# Altium schematic sheet 1.CONNECTOR.SchDoc
size 513 x 386 mm
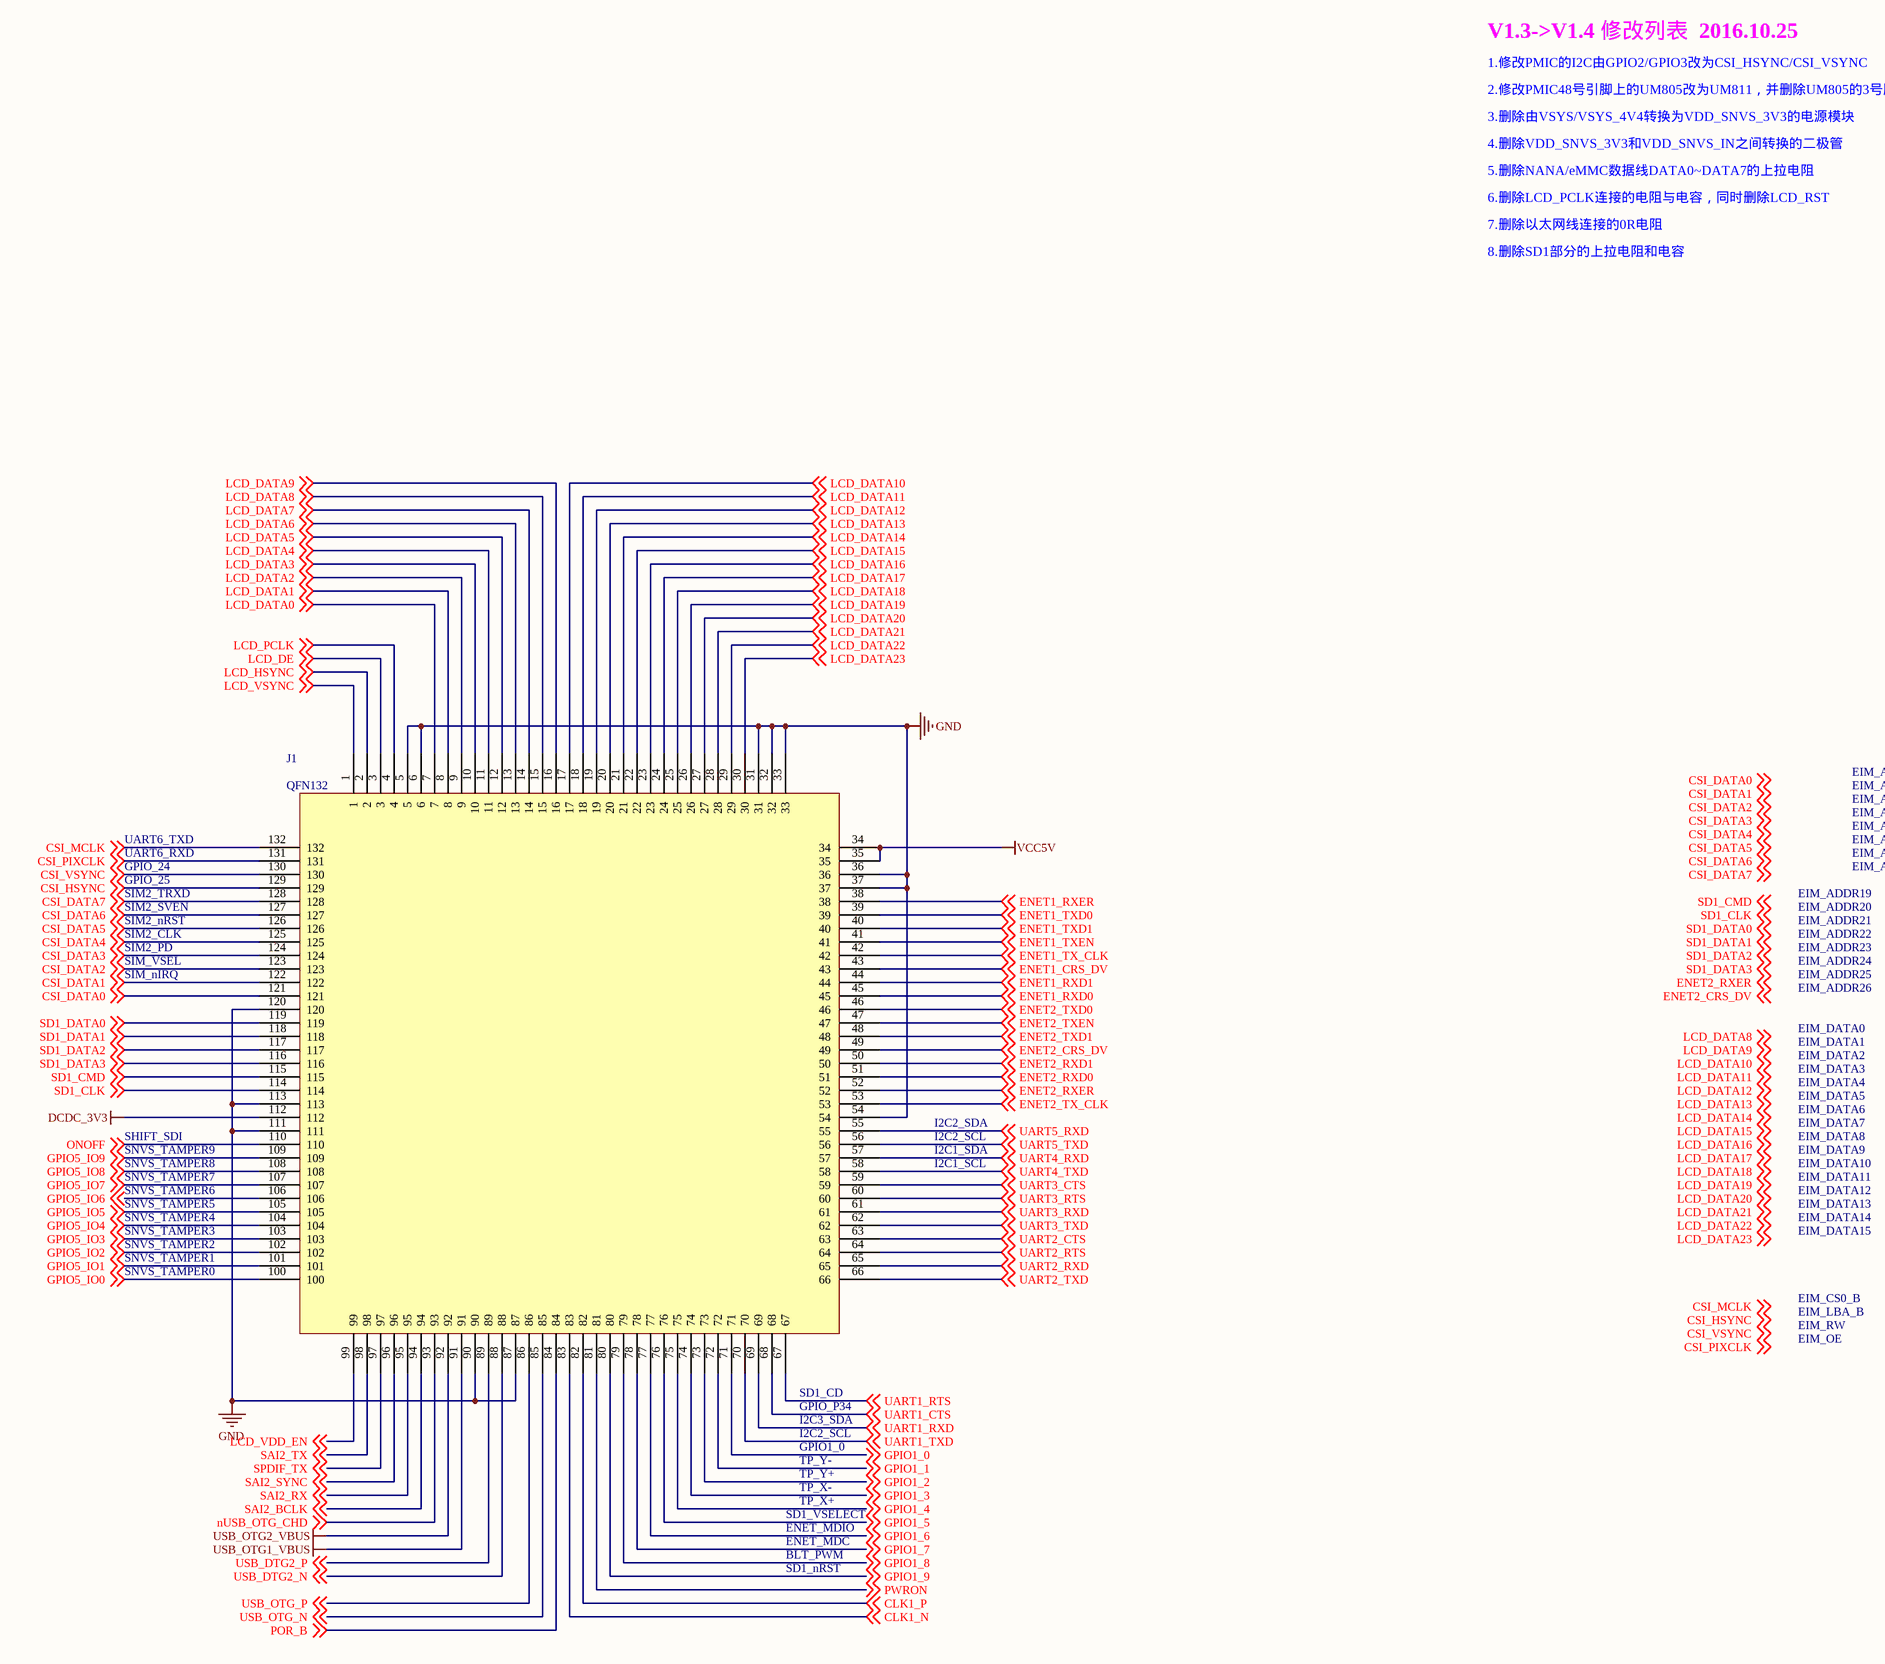
[diagram p0: 1.CONNECTOR.SchDoc]

## Parts
J1  QFN132  [YPK33X4]

## Nets
DCDC_3V3: J1.112
GND: J1.5 J1.6 J1.31 J1.32 J1.33 J1.36 J1.37 J1.54 J1.87 J1.90 J1.111 J1.113 J1.120
USB_OTG1_VBUS: J1.91
USB_OTG2_VBUS: J1.92
VCC5V: J1.34 J1.35
CLK1_N: J1.83 ; off-sheet CLK1_N
CLK1_P: J1.82 ; off-sheet CLK1_P
CSI_DATA0: J1.121 ; off-sheet CSI_DATA0
CSI_DATA1: J1.122 ; off-sheet CSI_DATA1
CSI_DATA2: J1.123 ; off-sheet CSI_DATA2
CSI_DATA3: J1.124 ; off-sheet CSI_DATA3
CSI_DATA4: J1.125 ; off-sheet CSI_DATA4
CSI_DATA5: J1.126 ; off-sheet CSI_DATA5
CSI_DATA6: J1.127 ; off-sheet CSI_DATA6
CSI_DATA7: J1.128 ; off-sheet CSI_DATA7
CSI_HSYNC: J1.129 ; off-sheet CSI_HSYNC
CSI_MCLK: J1.132 ; off-sheet CSI_MCLK
CSI_PIXCLK: J1.131 ; off-sheet CSI_PIXCLK
CSI_VSYNC: J1.130 ; off-sheet CSI_VSYNC
ENET1_CRS_DV: J1.43 ; off-sheet ENET1_CRS_DV
ENET1_RXD0: J1.45 ; off-sheet ENET1_RXD0
ENET1_RXD1: J1.44 ; off-sheet ENET1_RXD1
ENET1_RXER: J1.38 ; off-sheet ENET1_RXER
ENET1_TX_CLK: J1.42 ; off-sheet ENET1_TX_CLK
ENET1_TXD0: J1.39 ; off-sheet ENET1_TXD0
ENET1_TXD1: J1.40 ; off-sheet ENET1_TXD1
ENET1_TXEN: J1.41 ; off-sheet ENET1_TXEN
ENET2_CRS_DV: J1.49 ; off-sheet ENET2_CRS_DV
ENET2_RXD0: J1.51 ; off-sheet ENET2_RXD0
ENET2_RXD1: J1.50 ; off-sheet ENET2_RXD1
ENET2_RXER: J1.52 ; off-sheet ENET2_RXER
ENET2_TX_CLK: J1.53 ; off-sheet ENET2_TX_CLK
ENET2_TXD0: J1.46 ; off-sheet ENET2_TXD0
ENET2_TXD1: J1.48 ; off-sheet ENET2_TXD1
ENET2_TXEN: J1.47 ; off-sheet ENET2_TXEN
GPIO1_0: J1.71 ; off-sheet GPIO1_0
GPIO1_1: J1.72 ; off-sheet GPIO1_1
GPIO1_2: J1.73 ; off-sheet GPIO1_2
GPIO1_3: J1.74 ; off-sheet GPIO1_3
GPIO1_4: J1.75 ; off-sheet GPIO1_4
GPIO1_5: J1.76 ; off-sheet GPIO1_5
GPIO1_6: J1.77 ; off-sheet GPIO1_6
GPIO1_7: J1.78 ; off-sheet GPIO1_7
GPIO1_8: J1.79 ; off-sheet GPIO1_8
GPIO1_9: J1.80 ; off-sheet GPIO1_9
GPIO5_IO0: J1.100 ; off-sheet GPIO5_IO0
GPIO5_IO1: J1.101 ; off-sheet GPIO5_IO1
GPIO5_IO2: J1.102 ; off-sheet GPIO5_IO2
GPIO5_IO3: J1.103 ; off-sheet GPIO5_IO3
GPIO5_IO4: J1.104 ; off-sheet GPIO5_IO4
GPIO5_IO5: J1.105 ; off-sheet GPIO5_IO5
GPIO5_IO6: J1.106 ; off-sheet GPIO5_IO6
GPIO5_IO7: J1.107 ; off-sheet GPIO5_IO7
GPIO5_IO8: J1.108 ; off-sheet GPIO5_IO8
GPIO5_IO9: J1.109 ; off-sheet GPIO5_IO9
LCD_DATA0: J1.7 ; off-sheet LCD_DATA0
LCD_DATA1: J1.8 ; off-sheet LCD_DATA1
LCD_DATA2: J1.9 ; off-sheet LCD_DATA2
LCD_DATA3: J1.10 ; off-sheet LCD_DATA3
LCD_DATA4: J1.11 ; off-sheet LCD_DATA4
LCD_DATA5: J1.12 ; off-sheet LCD_DATA5
LCD_DATA6: J1.13 ; off-sheet LCD_DATA6
LCD_DATA7: J1.14 ; off-sheet LCD_DATA7
LCD_DATA8: J1.15 ; off-sheet LCD_DATA8
LCD_DATA9: J1.16 ; off-sheet LCD_DATA9
LCD_DATA10: J1.17 ; off-sheet LCD_DATA10
LCD_DATA11: J1.18 ; off-sheet LCD_DATA11
LCD_DATA12: J1.19 ; off-sheet LCD_DATA12
LCD_DATA13: J1.20 ; off-sheet LCD_DATA13
LCD_DATA14: J1.21 ; off-sheet LCD_DATA14
LCD_DATA15: J1.22 ; off-sheet LCD_DATA15
LCD_DATA16: J1.23 ; off-sheet LCD_DATA16
LCD_DATA17: J1.24 ; off-sheet LCD_DATA17
LCD_DATA18: J1.25 ; off-sheet LCD_DATA18
LCD_DATA19: J1.26 ; off-sheet LCD_DATA19
LCD_DATA20: J1.27 ; off-sheet LCD_DATA20
LCD_DATA21: J1.28 ; off-sheet LCD_DATA21
LCD_DATA22: J1.29 ; off-sheet LCD_DATA22
LCD_DATA23: J1.30 ; off-sheet LCD_DATA23
LCD_DE: J1.3 ; off-sheet LCD_DE
LCD_HSYNC: J1.2 ; off-sheet LCD_HSYNC
LCD_PCLK: J1.4 ; off-sheet LCD_PCLK
LCD_VDD_EN: J1.99 ; off-sheet LCD_VDD_EN
LCD_VSYNC: J1.1 ; off-sheet LCD_VSYNC
nUSB_OTG_CHD: J1.93 ; off-sheet nUSB_OTG_CHD
ONOFF: J1.110 ; off-sheet ONOFF
POR_B: J1.84 ; off-sheet POR_B
PWRON: J1.81 ; off-sheet PWRON
SAI2_BCLK: J1.94 ; off-sheet SAI2_BCLK
SAI2_RX: J1.95 ; off-sheet SAI2_RX
SAI2_SYNC: J1.96 ; off-sheet SAI2_SYNC
SAI2_TX: J1.98 ; off-sheet SAI2_TX
SD1_CLK: J1.114 ; off-sheet SD1_CLK
SD1_CMD: J1.115 ; off-sheet SD1_CMD
SD1_DATA0: J1.119 ; off-sheet SD1_DATA0
SD1_DATA1: J1.118 ; off-sheet SD1_DATA1
SD1_DATA2: J1.117 ; off-sheet SD1_DATA2
SD1_DATA3: J1.116 ; off-sheet SD1_DATA3
SPDIF_TX: J1.97 ; off-sheet SPDIF_TX
UART1_CTS: J1.68 ; off-sheet UART1_CTS
UART1_RTS: J1.67 ; off-sheet UART1_RTS
UART1_RXD: J1.69 ; off-sheet UART1_RXD
UART1_TXD: J1.70 ; off-sheet UART1_TXD
UART2_CTS: J1.63 ; off-sheet UART2_CTS
UART2_RTS: J1.64 ; off-sheet UART2_RTS
UART2_RXD: J1.65 ; off-sheet UART2_RXD
UART2_TXD: J1.66 ; off-sheet UART2_TXD
UART3_CTS: J1.59 ; off-sheet UART3_CTS
UART3_RTS: J1.60 ; off-sheet UART3_RTS
UART3_RXD: J1.61 ; off-sheet UART3_RXD
UART3_TXD: J1.62 ; off-sheet UART3_TXD
UART4_RXD: J1.57 ; off-sheet UART4_RXD
UART4_TXD: J1.58 ; off-sheet UART4_TXD
UART5_RXD: J1.55 ; off-sheet UART5_RXD
UART5_TXD: J1.56 ; off-sheet UART5_TXD
USB_DTG2_N: J1.88 ; off-sheet USB_DTG2_N
USB_DTG2_P: J1.89 ; off-sheet USB_DTG2_P
USB_OTG_N: J1.85 ; off-sheet USB_OTG_N
USB_OTG_P: J1.86 ; off-sheet USB_OTG_P

## Notes on the sheet
- V1.3->V1.4 修改列表  2016.10.25
- 1.修改PMIC的I2C由GPIO2/GPIO3改为CSI_HSYNC/CSI_VSYNC
- 2.修改PMIC48号引脚上的UM805改为UM811，并删除UM805的3号脚的上拉电阻
- 3.删除由VSYS/VSYS_4V4转换为VDD_SNVS_3V3的电源模块
- 4.删除VDD_SNVS_3V3和VDD_SNVS_IN之间转换的二极管
- 5.删除NANA/eMMC数据线DATA0~DATA7的上拉电阻
- 6.删除LCD_PCLK连接的电阻与电容，同时删除LCD_RST
- 7.删除以太网线连接的0R电阻
- 8.删除SD1部分的上拉电阻和电容
- EIM_AD0
- EIM_AD4
- EIM_AD3
- EIM_AD2
- EIM_AD1
- UART6_TXD
- UART6_RXD
- GPIO_24
- GPIO_25
- SIM2_TRXD
- EIM_ADDR19
- EIM_AD7
- EIM_AD6
- EIM_AD5
- SIM_VSEL
- SIM2_PD
- SIM2_CLK
- SIM2_nRST
- SIM2_SVEN
- EIM_ADDR20
- EIM_ADDR21
- EIM_ADDR22
- EIM_ADDR23
- EIM_ADDR24
- SIM_nIRQ
- EIM_ADDR26
- EIM_ADDR25
- EIM_DATA0
- EIM_DATA1
- EIM_DATA2
- EIM_DATA3
- EIM_DATA4
- EIM_DATA5
- SNVS_TAMPER8
- SNVS_TAMPER9
- SHIFT_SDI
- I2C1_SCL
- I2C1_SDA
- I2C2_SCL
- I2C2_SDA
- EIM_DATA6
- EIM_DATA7
- EIM_DATA8
- EIM_DATA9
- EIM_DATA10
- SNVS_TAMPER3
- SNVS_TAMPER4
- SNVS_TAMPER5
- SNVS_TAMPER7
- SNVS_TAMPER6
- EIM_DATA11
- EIM_DATA12
- EIM_DATA13
- EIM_DATA14
- EIM_DATA15
- SNVS_TAMPER0
- SNVS_TAMPER1
- SNVS_TAMPER2
- EIM_CS0_B
- EIM_LBA_B
- EIM_RW
- EIM_OE
- I2C3_SDA
- SD1_CD
- GPIO_P34
- GPIO1_0
- TP_Y-
- TP_Y+
- TP_X-
- TP_X+
- SD1_VSELECT
- ENET_MDIO
- ENET_MDC
- BLT_PWM
- SD1_nRST
- Labels drawn without touching a wire or pin: CSI_DATA0, CSI_DATA1, CSI_DATA2, CSI_DATA3, CSI_DATA4, CSI_DATA5, CSI_DATA6, CSI_DATA7, CSI_HSYNC, CSI_MCLK, CSI_PIXCLK, CSI_VSYNC, ENET2_CRS_DV, ENET2_RXER, LCD_DATA8, LCD_DATA9, LCD_DATA10, LCD_DATA11, LCD_DATA12, LCD_DATA13, LCD_DATA14, LCD_DATA15, LCD_DATA16, LCD_DATA17, LCD_DATA18, LCD_DATA19, LCD_DATA20, LCD_DATA21, LCD_DATA22, LCD_DATA23, SD1_CLK, SD1_CMD, SD1_DATA0, SD1_DATA1, SD1_DATA2, SD1_DATA3